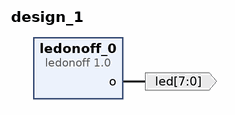
[diagram p0: block diagram of the top level]
# Vivado block design design_1, xc7z020clg400-1, Vivado 2020.2
create_bd_design design_1

create_bd_port -dir O -from 7 -to 0 -type data led

create_bd_cell -type ip -vlnv xilinx.com:hls:ledonoff:1.0 ledonoff_0

# ---- connections ----

connect_bd_net [get_bd_pins ledonoff_0/o] [get_bd_ports led]

validate_bd_design
save_bd_design
